# Altium schematic sheet Current_Detection_1_8.SchDoc: S88-N Occupancy Detector
size A4; DrawnBy: Sem Kirkels; DocumentNumber: 23P001S05; Revision: V1; SheetNumber: 5; SheetTotal: 6
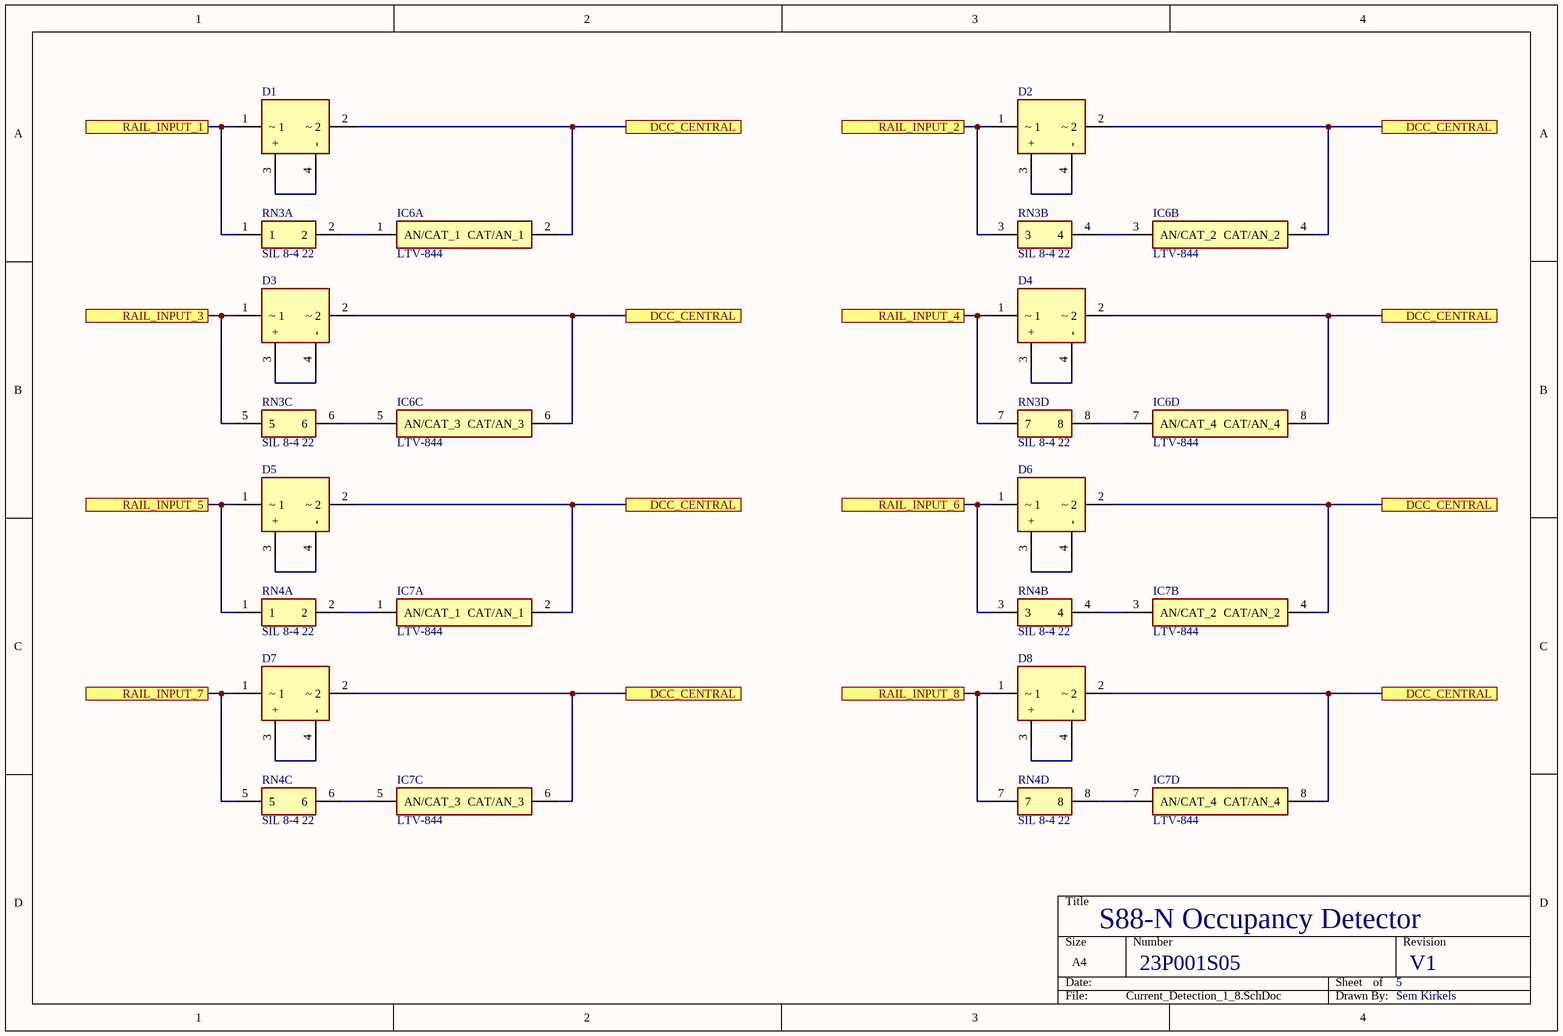
[diagram p0: Current_Detection_1_8.SchDoc]

## Parts
D1  B140C1000DIP_DB101  [FBR_B140C1000DIP]  (value not drawn)
D2  B140C1000DIP_DB101  [FBR_B140C1000DIP]  (value not drawn)
D3  B140C1000DIP_DB101  [FBR_B140C1000DIP]  (value not drawn)
D4  B140C1000DIP_DB101  [FBR_B140C1000DIP]  (value not drawn)
D5  B140C1000DIP_DB101  [FBR_B140C1000DIP]  (value not drawn)
D6  B140C1000DIP_DB101  [FBR_B140C1000DIP]  (value not drawn)
D7  B140C1000DIP_DB101  [FBR_B140C1000DIP]  (value not drawn)
D8  B140C1000DIP_DB101  [FBR_B140C1000DIP]  (value not drawn)
IC6  LTV-844  [CD4014]  (parts A,B,C,D of 5)
IC7  LTV-844  [CD4014]  (parts A,B,C,D of 5)
RN3  SIL 8-4 22  [SIL 8-4]  (parts A,B,C,D of 4)
RN4  SIL 8-4 22  [SIL 8-4]  (parts A,B,C,D of 4)

## Ports
DCC_CENTRAL (see Current_Detection_1_8[2A], Current_Detection_1_8[2B], Current_Detection_1_8[2C], Current_Detection_1_8[4A], Current_Detection_1_8[4B], Current_Detection_1_8[4C], Current_Detection_9_16[2A], Current_Detection_9_16[2B], Current_Detection_9_16[2C], Current_Detection_9_16[4A], Current_Detection_9_16[4B], Current_Detection_9_16[4C], Current_Detection_Connectors[3C]), DCC_CENTRAL (see Current_Detection_1_8[2A], Current_Detection_1_8[2B], Current_Detection_1_8[2C], Current_Detection_1_8[4A], Current_Detection_1_8[4B], Current_Detection_9_16[2A], Current_Detection_9_16[2B], Current_Detection_9_16[2C], Current_Detection_9_16[4A], Current_Detection_9_16[4B], Current_Detection_9_16[4C], Current_Detection_Connectors[3C]), DCC_CENTRAL (see Current_Detection_1_8[2A], Current_Detection_1_8[2B], Current_Detection_1_8[2C], Current_Detection_1_8[4B], Current_Detection_1_8[4C], Current_Detection_9_16[2A], Current_Detection_9_16[2B], Current_Detection_9_16[2C], Current_Detection_9_16[4A], Current_Detection_9_16[4B], Current_Detection_9_16[4C], Current_Detection_Connectors[3C]), DCC_CENTRAL (see Current_Detection_1_8[2A], Current_Detection_1_8[2B], Current_Detection_1_8[4A], Current_Detection_1_8[4B], Current_Detection_1_8[4C], Current_Detection_9_16[2A], Current_Detection_9_16[2B], Current_Detection_9_16[2C], Current_Detection_9_16[4A], Current_Detection_9_16[4B], Current_Detection_9_16[4C], Current_Detection_Connectors[3C]), DCC_CENTRAL (see Current_Detection_1_8[2B], Current_Detection_1_8[2C], Current_Detection_1_8[4A], Current_Detection_1_8[4B], Current_Detection_1_8[4C], Current_Detection_9_16[2A], Current_Detection_9_16[2B], Current_Detection_9_16[2C], Current_Detection_9_16[4A], Current_Detection_9_16[4B], Current_Detection_9_16[4C], Current_Detection_Connectors[3C]), RAIL_INPUT_1 (see Current_Detection_Connectors[3A]), RAIL_INPUT_2 (see Current_Detection_Connectors[3A]), RAIL_INPUT_3 (see Current_Detection_Connectors[3A]), RAIL_INPUT_4 (see Current_Detection_Connectors[3A]), RAIL_INPUT_5 (see Current_Detection_Connectors[3A]), RAIL_INPUT_6 (see Current_Detection_Connectors[3A]), RAIL_INPUT_7 (see Current_Detection_Connectors[3A]), RAIL_INPUT_8 (see Current_Detection_Connectors[3A])

## Nets
DCC_CENTRAL: D1.2(~_2) D2.2(~_2) D3.2(~_2) D4.2(~_2) D5.2(~_2) D6.2(~_2) D7.2(~_2) D8.2(~_2) IC6.2(CAT/AN_1) IC6.4(CAT/AN_2) IC6.6(CAT/AN_3) IC6.8(CAT/AN_4) IC7.2(CAT/AN_1) IC7.4(CAT/AN_2) IC7.6(CAT/AN_3) IC7.8(CAT/AN_4) ; port DCC_CENTRAL
RAIL_INPUT_1: D1.1(~_1) RN3.1 ; port RAIL_INPUT_1
RAIL_INPUT_2: D2.1(~_1) RN3.3 ; port RAIL_INPUT_2
RAIL_INPUT_3: D3.1(~_1) RN3.5 ; port RAIL_INPUT_3
RAIL_INPUT_4: D4.1(~_1) RN3.7 ; port RAIL_INPUT_4
RAIL_INPUT_5: D5.1(~_1) RN4.1 ; port RAIL_INPUT_5
RAIL_INPUT_6: D6.1(~_1) RN4.3 ; port RAIL_INPUT_6
RAIL_INPUT_7: D7.1(~_1) RN4.5 ; port RAIL_INPUT_7
RAIL_INPUT_8: D8.1(~_1) RN4.7 ; port RAIL_INPUT_8
NetD1_3: D1.3(+) D1.4(-)
NetD2_3: D2.3(+) D2.4(-)
NetD3_3: D3.3(+) D3.4(-)
NetD4_3: D4.3(+) D4.4(-)
NetD5_3: D5.3(+) D5.4(-)
NetD6_3: D6.3(+) D6.4(-)
NetD7_3: D7.3(+) D7.4(-)
NetD8_3: D8.3(+) D8.4(-)
NetIC6_1: IC6.1(AN/CAT_1) RN3.2
NetIC6_3: IC6.3(AN/CAT_2) RN3.4
NetIC6_5: IC6.5(AN/CAT_3) RN3.6
NetIC6_7: IC6.7(AN/CAT_4) RN3.8
NetIC7_1: IC7.1(AN/CAT_1) RN4.2
NetIC7_3: IC7.3(AN/CAT_2) RN4.4
NetIC7_5: IC7.5(AN/CAT_3) RN4.6
NetIC7_7: IC7.7(AN/CAT_4) RN4.8

## Library data of the parts
D1-D8 = B140C1000DIP_DB101: Bridge Rectifier; Manufacturer_Name: Rectron; Manufacturer_Part_Number: DB101; Datasheet Link: http://www.rectron.com/data_sheets/db101-107.pdf; Height: 4.9mm; Mouser Part Number: 583-DB101; Mouser Price/Stock: https://www.mouser.co.uk/ProductDetail/Rectron/DB101?qs=G5AQjGfRJcKGSaxDP6qXzQ%3D%3D
IC6 IC7 = LTV-844: Integrated Circuit; Manufacturer_Name: Lite-On; Datasheet Link: https://componentsearchengine.com/Datasheets/1/LTV-844.pdf; Height: 4.5mm; Manufacturer_Part_Number: LTV-844; Mouser Part Number: 859-LTV-844; Mouser Price/Stock: https://www.mouser.co.uk/ProductDetail/Lite-On/LTV-844?qs=BZ0sscl82p8P4kyBjSwzAg%3D%3D; Arrow Part Number: LTV-844; Arrow Price/Stock: https://www.arrow.com/en/products/ltv-844/lite-on-technology?region=nac
RN3 RN4 = SIL 8-4 22: Resistor Network; Manufacturer_Name: Bourns; Manufacturer_Part_Number: 4608X-102-102LF; Datasheet Link: http://www.bourns.com/pdfs/4600X.pdf; Height: 5.08mm; Mouser Part Number: 652-4608X-2LF-1K; Mouser Price/Stock: https://www.mouser.co.uk/ProductDetail/Bourns/4608X-102-102LF?qs=EFWIAreJVABaVln%252BuPVHjA%3D%3D; Arrow Part Number: 4608X-102-102LF; Arrow Price/Stock: https://www.arrow.com/en/products/4608x-102-102lf/bourns?region=europe